# EAGLE design thermostat (EAGLE 5.11)
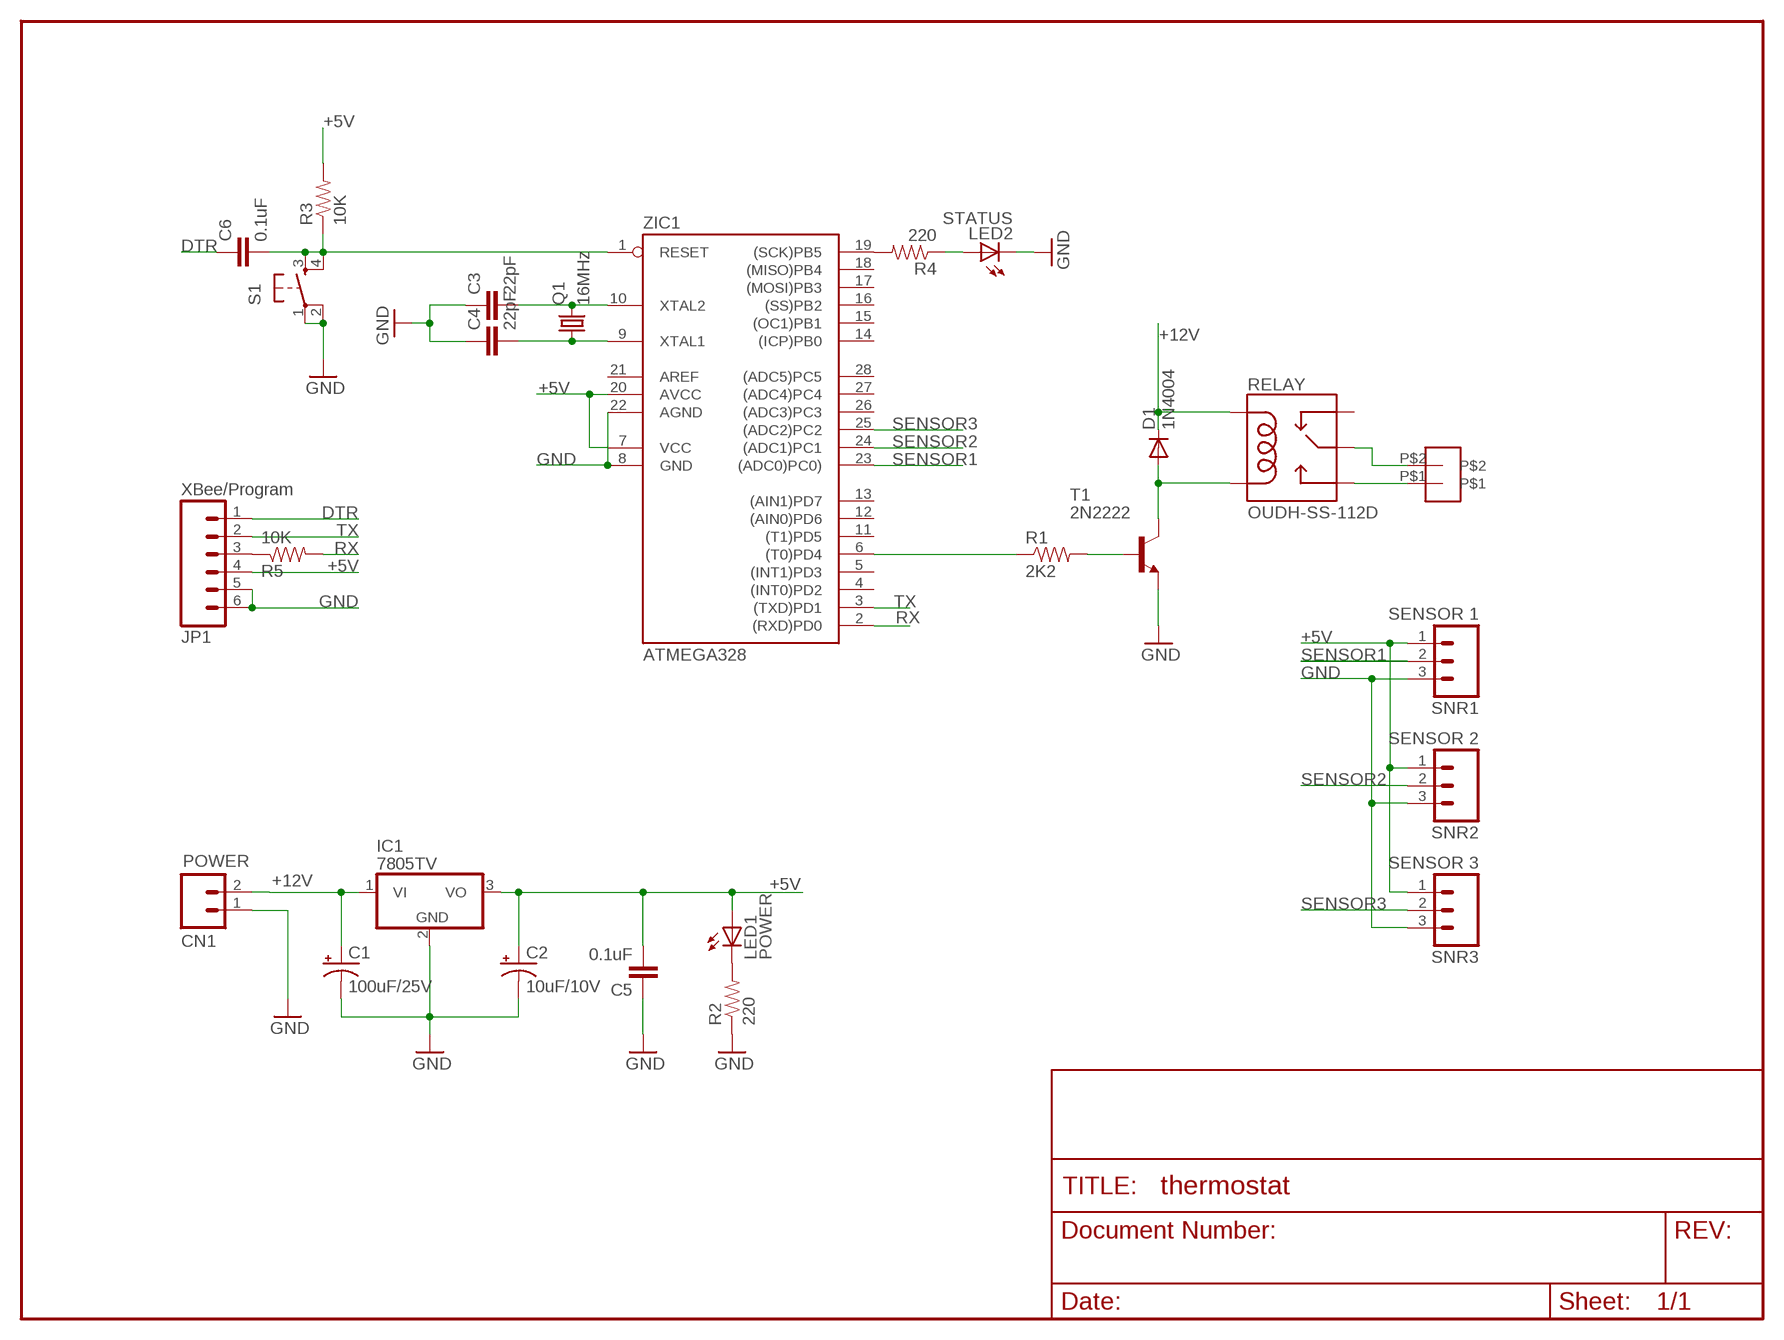
[diagram p0: schematic, sheet 1]

## Parts
C1  100uF/25V  CAP_POLPTH1  [CPOL-RADIAL-100UF-25V]
C2  10uF/10V  CAP_POLPTH1  [CPOL-RADIAL-100UF-25V]
C3  22pF  CAPPTH  [CAP-PTH-SMALL]
C4  22pF  CAPPTH  [CAP-PTH-SMALL]
C5  0.1uF  CAPPTH  [CAP-PTH-SMALL]
C6  0.1uF  CAPPTH  [CAP-PTH-SMALL]
CN1  POWER  M02JST-PTH-2  [JST-2-PTH]
D1  1N4004  [DO41-10]
IC1  7805TV  [TO220V]
JP1  XBee/Program  M06SIP  [1X06]
LED1  POWER  LED3MM  [LED3MM]
LED2  STATUS  LED3MM  [LED3MM]
LOAD  TA5.0X2  [TA5.0X2]
Q1  16MHz  CRYSTALHC49S  [HC49/S]
R1  2K2  RESISTORAXIAL-0.3  [AXIAL-0.3]
R2  220  RESISTORAXIAL-0.3  [AXIAL-0.3]
R3  10K  RESISTORAXIAL-0.3  [AXIAL-0.3]
R4  220  RESISTORAXIAL-0.3  [AXIAL-0.3]
R5  10K  RESISTORAXIAL-0.3  [AXIAL-0.3]
RELAY  OUDH-SS-112D  [OUDH-SS-112D]
S1  TAC_SWITCHPTH  [TACTILE-PTH]
SNR1  SENSOR 1  M03JST-PTH  [JST-3-PTH]
SNR2  SENSOR 2  M03JST-PTH  [JST-3-PTH]
SNR3  SENSOR 3  M03JST-PTH  [JST-3-PTH]
T1  2N2222  [TO18]
ZIC1  ATMEGA328  AT90S4433P  [DIL28-3]

## Nets
+5V: C2.1(+) C5.2 IC1.3(VO) JP1.4 LED1.A R3.P$2 SNR1.1 SNR2.1 SNR3.1 ZIC1.7(VCC) ZIC1.20(AVCC)
+12V: C1.1(+) CN1.2 D1.C IC1.1(VI) RELAY.COIL1
DTR: C6.1 JP1.1
GND: C1.2(-) C2.2(-) C3.1 C4.1 C5.1 CN1.1 IC1.2(GND) JP1.5 JP1.6 LED2.K(C) R2.P$1 S1.1 S1.2 SNR1.3 SNR2.3 SNR3.3 T1.1(E) ZIC1.8(GND) ZIC1.22(AGND)
N$1: D1.A RELAY.COIL2 T1.3(C)
N$2: LOAD.P$2 RELAY.MAIN
N$3: LOAD.P$1 RELAY.NO
N$4: R1.P$2 T1.2(B)
N$5: C3.2 Q1.2 ZIC1.10(XTAL2)
N$6: LED1.K(C) R2.P$2
N$7: C4.2 Q1.1 ZIC1.9(XTAL1)
N$8: C6.2 R3.P$1 S1.3 S1.4 ZIC1.1(RESET)
N$9: JP1.3 R5.P$1
N$11: R4.P$2 ZIC1.19((SCK)PB5)
N$12: LED2.A R4.P$1
RELAY: R1.P$1 ZIC1.6((T0)PD4)
RX: R5.P$2 ZIC1.2((RXD)PD0)
SENSOR1: SNR1.2 ZIC1.23((ADC0)PC0))
SENSOR2: SNR2.2 ZIC1.24((ADC1)PC1)
SENSOR3: SNR3.2 ZIC1.25((ADC2)PC2)
TX: JP1.2 ZIC1.3((TXD)PD1)
Unconnected: RELAY.NC ZIC1.4((INT0)PD2) ZIC1.5((INT1)PD3) ZIC1.11((T1)PD5) ZIC1.12((AIN0)PD6) ZIC1.13((AIN1)PD7) ZIC1.14((ICP)PB0) ZIC1.15((OC1)PB1) ZIC1.16((SS)PB2) ZIC1.17((MOSI)PB3) ZIC1.18((MISO)PB4) ZIC1.21(AREF) ZIC1.26((ADC3)PC3) ZIC1.27((ADC4)PC4) ZIC1.28((ADC5)PC5)

## Library data of the parts
C1 C2 = SparkFun:CAP_POL: Capacitor Polarized These are standard SMD and PTH capacitors. Normally 10uF, 47uF, and 100uF in electrolytic and tantalum varieties. Always verify the external diameter of the through hole cap, it varies with capacity, voltage, and manufacturer. The EIA devices should be standard.
C3-C6 = SparkFun:CAP: Capacitor Standard 0603 ceramic capacitor, and 0.1" leaded capacitor.
CN1 = SparkFun:M02: Header 2 Standard 2-pin 0.1" header. Use with straight break away headers (SKU : PRT-00116), right angle break away headers (PRT-00553), swiss pins (PRT-00743), machine pins (PRT-00117), and female headers (PRT-00115). Molex polarized connector foot print use with SKU : PRT-08233 with associated crimp pins and housings.
D1 = adafruit:1N4004: DIODE General purpose 1N400x type rectifier (With bigger pads) http://www.ladyada.net/library/pcb/eaglelibrary.html
IC1 = linear:78*: Positive VOLTAGE REGULATOR Source: http://cache.national.com/ds/LM/LM78L05.pdf http://www.fairchildsemi.com/ds/LM/LM7805.pdf
JP1 = SparkFun:M06: Header 6 Standard 6-pin 0.1" header. Use with straight break away headers (SKU : PRT-00116), right angle break away headers (PRT-00553), swiss pins (PRT-00743), machine pins (PRT-00117), and female headers (PRT-00115). Molex polarized connector foot print use with SKU : PRT-08094 with associated crimp pins and housings. NOTES ON THE VARIANTS LOCK and LOCK_LONGPADS... This footprint was designed to help hold the alignment of a through-hole component (i.e. 6-pin header) while soldering it into place. You may notice that each hole has been shifted either up or down by 0.005 of an inch from it's more standard position (which is a perfectly straight line). This slight alteration caused the pins (the squares in the middle) to touch the edges of the holes. Because they are alternating, it causes a "brace" to hold the component in place. 0.005 has proven to be the perfect amount of "off-center" position when using our standard breakaway headers. Although looks a little odd when you look at the bare footprint, once you have a header in there, the alteration is very hard to notice. Also, if you push a header all the way into place, it is covered up entirely on the bottom side. This idea of altering the position of holes to aid alignment will be further integrated into the Sparkfun Library for other footprints. It can help hold any component with 3 or more connection pins.
LED1 LED2 = adafruit:LED: LED OSRAM: - CHIPLED LG R971, LG N971, LY N971, LG Q971, LY Q971, LO R971, LY R971 LH N974, LH R974 LS Q976, LO Q976, LY Q976 LO Q996 - Hyper CHIPLED LW Q18S LB Q993, LB Q99A, LB R99A - SideLED LS A670, LO A670, LY A670, LG A670, LP A670 LB A673, LV A673, LT A673, LW A673 LH A674 LY A675 LS A676, LA A676, LO A676, LY A676, LW A676 LS A679, LY A679, LG A679 - Hyper Micro SIDELED® LS Y876, LA Y876, LO Y876, LY Y876 LT Y87S - SmartLED LW L88C, LW L88S LB L89C, LB L89S, LG L890 LS L89K, LO L89K, LY L89K LS L896, LA L896, LO L896, LY L896 - TOPLED LS T670, LO T670, LY T670, LG T670, LP T670 LSG T670, LSP T670, LSY T670, LOP T670, LYG T670 LG T671, LOG T671, LSG T671 LB T673, LV T673, LT T673, LW T673 LH T674 LS T676, LA T676, LO T676, LY T676, LB T676, LH T676, LSB T676, LW T676 LB T67C, LV T67C, LT T67C, LS T67K, LO T67K, LY T67K, LW E67C LS E67B, LA E67B, LO E67B, LY E67B, LB E67C, LV E67C, LT E67C LW T67C LS T679, LY T679, LG T679 LS T770, LO T770, LY T770, LG T770, LP T770 LB T773, LV T773, LT T773, LW T773 LH T774 LS E675, LA E675, LY E675, LS T675 LS T776, LA T776, LO T776, LY T776, LB T776 LHGB T686 LT T68C, LB T68C - Hyper Mini TOPLED® LB M676 - Mini TOPLED Santana® LG M470 LS M47K, LO M47K, LY M47K Source: http://www.osram.convergy.de/
LOAD = sudarkoff:TA5.0X2: OST TA 5.0mm Terminal Material Terminal body Metal housing: Brass (CuZn) Terminal screw: Steel Zinc plating "-" slot type Wire guard: Stainless steel Surface of solder tail: Tin plated Insulator (housing): Thermoplastic (UL94V-0) Electrical UL/CSA/VDE Voltage rating: 250VAC/250VAC/250VAC Current rating: 16A Wire range: 1.0-2.5mm2 Solid wire (AWG): 14-26/14-22 Stranded wire (AWG): 14-26/14-22 Torque: 2.6Lb-In/4Kgf.cm/0.6Nm Screw: M3 Wire strip length: 6-7mm Withstanding voltage: 1.5KV/1.5KV/2KV Operating temperature: -30°C to +105°C Soldering temperature: 250°C±10°C/5 Sec Part number: OSTTA(XX)01(Y)1 XX - NUMBER OF POLES 02 - 2 poles 03 - 3 poles ... - ... poles 24 - 24 poles Y - COLOR 0: Black 5: Green 6: Blue (standard) 8: Grey
Q1 = crystal:CRYSTAL: CRYSTAL; OC_FARNELL: 1667008; OC_NEWARK: unknown
R1-R5 = SparkFun:RESISTOR: Resistor Basic schematic elements and footprints for 0603, 1206, and PTH resistors.
RELAY = sudarkoff:OUDH-SS-112D
S1 = SparkFun:TAC_SWITCH: Momentary Switch Button commonly used for reset or general input. Spark Fun Electronics SKU : COM-00097
SNR1-SNR3 = SparkFun:M03: Header 3 Standard 3-pin 0.1" header. Use with straight break away headers (SKU : PRT-00116), right angle break away headers (PRT-00553), swiss pins (PRT-00743), machine pins (PRT-00117), and female headers (PRT-00115). Molex polarized connector foot print use with SKU : PRT-08232 with associated crimp pins and housings.
T1 = transistor:2N2222: NPN TRANSISTOR
ZIC1 = atmel:AT90S4433: MICROCONTROLLER 4 Kbytes FLASH 128 bytes SRAM 256 bytes EEPROM UART 6-channel 10 bit ADC

## Net classes
0 default: width 0.254 mm, clearance 0.254 mm
2 gnd: width 0.305 mm, drill 0.559 mm, clearance 0.254 mm
3 usbvcc: width 0.508 mm, drill 0.61 mm, clearance 0.254 mm
4 aref: width 0.406 mm, drill 0.61 mm, clearance 0.254 mm

## Board
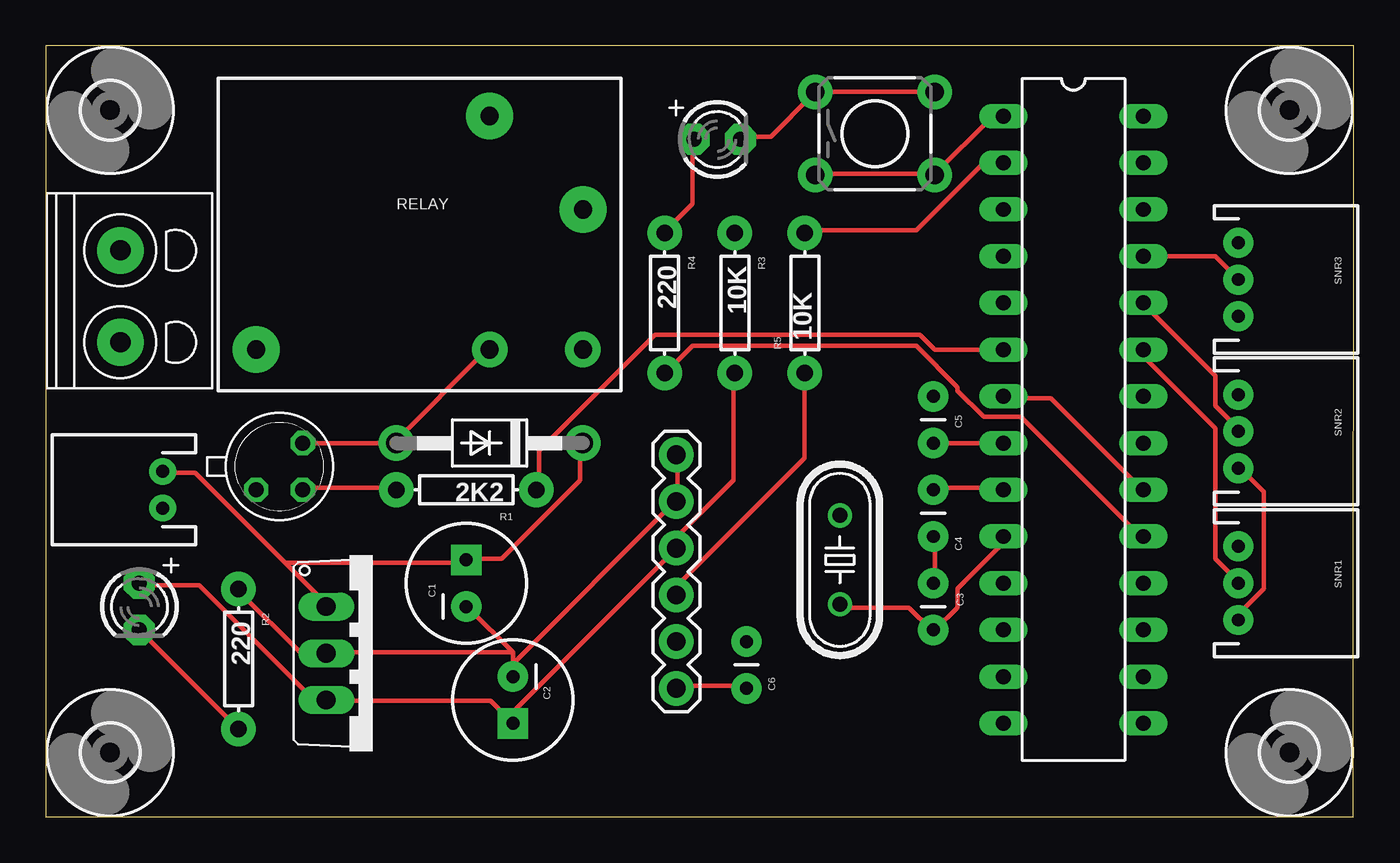
[diagram p1: board, top side]
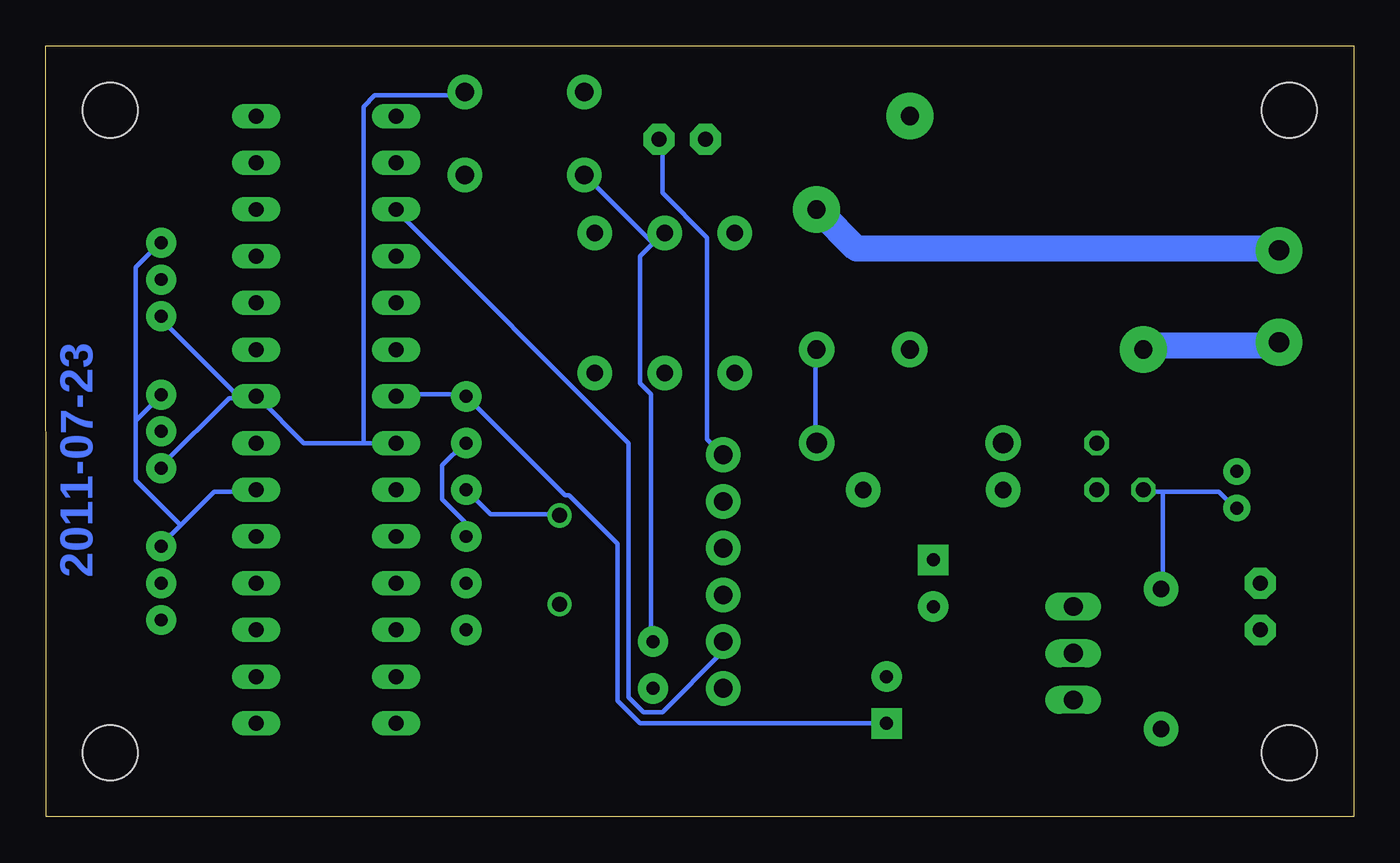
[diagram p2: board, bottom side, seen from below]

Size 71.12 x 41.91 mm. Coordinates in mm from the lower left corner, seen from the top.
Outline: 0,0 71.11,0 71.12,41.91 0,41.91 0,0
Copper layers (1*16): Top 0.035mm / dielectric 1.5mm / Bottom 0.035mm
Design rules "default": minimum track width 10mil, minimum drill 24mil, track to track 8mil, track to pad 8mil, pad to pad 8mil, via to via 8mil, smd to smd 8mil, copper to edge 40mil, drill to drill 8mil, minimum pad ring 10mil, minimum via ring 8mil, stop-mask expansion 4mil, vias tented up to drill 0mil, thermal gap 10mil

### Footprints (pad centres in the part's own frame; a part is rotated, then mirrored left to right if it is on the bottom)
CPOL-RADIAL-100UF-25V = drill 0.7 pad 1.651 square: 1 1.27,0 | drill 0.7 pad 1.651 round: 2 -1.27,0
CAP-PTH-SMALL = drill 0.7 pad 1.651 round: 1 0,0; 2 2.54,0
JST-2-PTH = drill 0.7 pad 1.448 round: 1 -1,0; 2 1,0
DO41-10 = drill 1.118 pad 1.93 round: A 5.08,0; C -5.08,0
TO220V = drill 1.016 long: 1 -2.54,-2.54; 2 0,-2.54; 3 2.54,-2.54
1X06 = drill 1.016 pad 1.88 round: 1 0,0; 2 2.54,0; 3 5.08,0; 4 7.62,0; 5 10.16,0; 6 12.7,0
LED3MM = drill 0.813 pad 1.676 octagon: A -1.27,0; K 1.27,0
TA5.0X2 = drill 1.1 pad 2.54 round: P$1 0,0; P$2 0,-5
HC49/S = drill 0.813 round: 1 -2.413,0; 2 2.413,0
AXIAL-0.3 = drill 0.9 pad 1.88 round: P$1 -3.81,0; P$2 3.81,0
OUDH-SS-112D = drill 1 pad 1.93 round: COIL1 8.89,-6.35; COIL2 3.81,-6.35 | drill 1 pad 2.54 round: MAIN -8.89,-6.35; NC 3.81,6.35; NO 8.89,1.27
TACTILE-PTH = drill 1.016 pad 1.88 round: 1 -3.251,2.261; 2 3.251,2.261; 3 -3.251,-2.261; 4 3.251,-2.261
JST-3-PTH = drill 0.7 pad 1.626 round: 1 -2,-5; 2 0,-5; 3 2,-5
TO18 = drill 0.813 octagon: 1 -1.27,-1.27; 2 1.27,-1.27; 3 1.27,1.27
MOUNTINGHOLE_3.0 = hole 3: 0,0
DIL28-3 = drill 0.813 long: 1 -16.51,-3.81; 2 -13.97,-3.81; 3 -11.43,-3.81; 4 -8.89,-3.81; 5 -6.35,-3.81; 6 -3.81,-3.81; 7 -1.27,-3.81; 8 1.27,-3.81; 9 3.81,-3.81; 10 6.35,-3.81; 11 8.89,-3.81; 12 11.43,-3.81; 13 13.97,-3.81; 14 16.51,-3.81; 15 16.51,3.81; 16 13.97,3.81; 17 11.43,3.81; 18 8.89,3.81; 19 6.35,3.81; 20 3.81,3.81; 21 1.27,3.81; 22 -1.27,3.81; 23 -3.81,3.81; 24 -6.35,3.81; 25 -8.89,3.81; 26 -11.43,3.81; 27 -13.97,3.81; 28 -16.51,3.81

### Placement (x,y rotation side)
C1  22.86,12.7 90 top
C2  25.4,6.35 270 top
C3  48.26,12.7 270 top
C4  48.26,15.24 90 top
C5  48.26,20.32 90 top
C6  38.1,6.99 90 top
CN1  6.35,17.78 90 top
D1  24.13,20.32 180 top
IC1  17.78,8.89 270 top
JP1  34.29,6.99 90 top
LED1  5.08,11.43 270 top
LED2  36.51,36.83 0 top
LOAD  4.05,30.8 0 top
Q1  43.18,13.97 270 top
R1  22.86,17.78 180 top
R2  10.48,8.57 270 top
R3  37.47,27.94 270 top
R4  33.66,27.94 270 top
R5  41.27,27.94 90 top
RELAY  20.32,31.75 0 top
S1  45.09,37.15 0 top
SNR1  69.85,12.7 270 top
SNR2  69.85,20.95 270 top
SNR3  69.85,29.21 270 top
T1  12.7,19.05 0 top
U$1  [MOUNTINGHOLE_3.0]  3.49,38.42 0 top
U$2  [MOUNTINGHOLE_3.0]  67.63,38.42 0 top
U$3  [MOUNTINGHOLE_3.0]  3.49,3.49 0 top
U$4  [MOUNTINGHOLE_3.0]  67.63,3.49 0 top
ZIC1  55.88,21.59 270 top

### Tracks (layer width: path | path; a pad name or v marks a point on that pad's centre or on a via)
+5V
  Top 0.254: ZIC1.7 52.22,22.76 54.66,22.76 59.54,17.88 ZIC1.20 | R3.P$2 37.39,23.98 37.39,18.29 34.34,15.24 34.34,14.63 JP1.4 34.14,14.43 25.2,5.49 24.99,5.49 | 24.99,5.49 C2.1 24.99,5.49 | 24.99,5.49 24.18,6.3 15.24,6.3 IC1.3 15.24,6.5 14.43,6.5 8.33,12.6 5.08,12.6 LED1.A
  Bottom 0.254: ZIC1.7 52.02,22.96 48.36,22.96 C5.2 48.16,22.76 42.88,17.48 42.67,17.48 40.03,14.83 40.03,6.3 38.81,5.08 C2.1 | 63.8,15.85 64.82,14.83 SNR1.1 | 63.8,15.85 61.98,17.68 59.74,17.68 ZIC1.20 | 66.24,21.54 65.02,22.76 SNR2.1 | 66.24,21.54 66.24,18.29 63.8,15.85 | 66.24,21.54 66.24,29.87 65.02,31.09 SNR3.1
+12V
  Top 0.254: 13.01,13.82 15.24,11.58 IC1.1 | 13.01,13.82 8.13,18.69 6.5,18.69 CN1.2 | 13.01,13.82 22.76,13.82 C1.1 22.96,14.02 24.79,14.02 29.06,18.29 29.06,20.32 D1.C
  Bottom 0.254: RELAY.COIL1 29.26,25.4 29.26,20.32 D1.C
DTR
  Top 0.254: C6.1 38,7.11 34.34,7.11 JP1.1
GND
  Top 0.254: C3.1 48.36,12.8 48.36,15.24 C4.1 | ZIC1.8 52.02,20.32 48.36,20.32 C5.1 | SNR1.3 65.02,10.77 65.02,11.18 66.24,12.39 66.24,17.68 65.02,18.9 SNR2.3 | 15.24,8.94 13.82,8.94 10.57,12.19 R2.P$1 | 15.24,8.94 IC1.2 15.24,8.94 | LED2.K 37.8,36.98 39.42,36.98 41.66,39.22 S1.1 41.86,39.42 48.16,39.42 S1.2 | JP1.6 34.34,19.51 34.34,17.27 JP1.5 34.14,17.07 25.4,8.33 | 25.4,8.94 25.4,8.33 | 25.4,8.33 25.4,7.72 C2.2 25.4,8.33 | 25.4,8.94 22.96,11.38 C1.2 | 15.24,8.94 25.4,8.94
  Bottom 0.254: C4.1 48.36,15.24 48.36,16.05 49.58,17.27 49.58,19.1 48.36,20.32 C5.1 | 60.55,22.76 61.16,22.76 64.82,19.1 SNR2.3 | 60.55,22.76 59.74,22.76 ZIC1.22 | 60.55,22.76 64.82,27.03 SNR3.3 | ZIC1.22 60.55,22.76 | 53.85,20.32 57.1,20.32 59.54,22.76 ZIC1.22 | 53.85,20.32 52.22,20.32 ZIC1.8 | 10.36,17.68 7.32,17.68 6.5,16.87 CN1.1 | 10.36,17.68 11.38,17.68 T1.1 | 10.36,17.68 10.36,12.39 R2.P$1 | LED2.K 37.59,36.78 37.59,33.93 35.15,31.5 35.15,20.52 34.34,19.71 JP1.6 | 53.85,20.32 53.85,38.61 53.24,39.22 48.36,39.22 S1.2
N$1
  Top 0.254: 18.9,20.32 23.98,25.4 RELAY.COIL2 | 18.9,20.32 D1.A 18.9,20.32 | 18.9,20.32 14.02,20.32 T1.3
N$2
  Bottom 0.254: LOAD.P$2 4.06,25.6
  Bottom 0.813: 11.18,25.6 11.38,25.4
  Bottom 1.422: 4.06,25.6 11.18,25.6 | 11.38,25.4 RELAY.MAIN
N$3
  Bottom 0.254: LOAD.P$1 4.06,30.89 | 29.06,32.92 RELAY.NO
  Bottom 1.422: 4.06,30.89 27.03,30.89 29.06,32.92
N$4
  Top 0.254: T1.2 14.02,17.88 18.9,17.88 R1.P$2
N$5
  Top 0.254: Q1.2 43.28,11.38 46.94,11.38 48.16,10.16 C3.2 48.36,10.16 49.58,11.38 49.58,12.39 52.02,14.83 52.02,15.24 ZIC1.10
N$6
  Top 0.254: LED1.K 10.36,4.88 R2.P$2
N$7
  Top 0.254: ZIC1.9 52.02,17.88 48.36,17.88 C4.2
  Bottom 0.254: Q1.1 43.28,16.46 46.94,16.46 48.16,17.68 C4.2
N$8
  Top 0.254: ZIC1.1 52.02,38 51.41,38 48.36,34.95 S1.4 48.16,34.95 41.86,34.95 S1.3
  Bottom 0.254: 38,31.29 37.59,31.7 R3.P$1 38,31.29 | 38,31.29 38.81,30.48 38.81,23.57 38.2,22.96 38.2,9.55 C6.2 | 38,31.29 38.2,31.29 41.66,34.75 S1.3
N$9
  Top 0.254: JP1.3 34.34,12.19 34.34,12.6 41.25,19.51 41.25,23.98 R5.P$1
N$11
  Top 0.254: ZIC1.19 59.54,15.24 53.03,21.74 51,21.74 49.58,23.16 49.58,23.37 47.35,25.6 35.15,25.6 33.73,24.18 R4.P$2
N$12
  Top 0.254: LED2.A 35.15,36.78 35.15,33.33 33.73,31.9 R4.P$1
RELAY
  Top 0.254: ZIC1.6 52.02,25.4 48.36,25.4 47.55,26.21 33.12,26.21 26.82,19.91 26.82,17.88 R1.P$1
RX
  Top 0.254: ZIC1.2 52.02,35.56 51,35.56 47.35,31.9 41.45,31.9 R5.P$2
SENSOR1
  Top 0.254: ZIC1.23 59.74,25.4 59.74,24.99 63.6,21.13 63.6,14.02 64.82,12.8 SNR1.2
SENSOR2
  Top 0.254: ZIC1.24 59.74,27.84 63.6,23.98 63.6,22.35 64.82,21.13 SNR2.2
SENSOR3
  Top 0.254: ZIC1.25 59.74,30.48 63.6,30.48 64.82,29.26 SNR3.2
TX
  Bottom 0.254: ZIC1.3 52.02,32.92 39.42,20.32 39.42,6.5 38.61,5.69 37.59,5.69 34.34,8.94 34.34,9.35 JP1.2

### Text on the board
Bottom: 2011-07-23
tValues: NC | NO | - o + | +12V | GND | - o + | CTS | 5V | RX | - o + | TX | DTR | Thermostat 1.1 - http://g.sud.to/ha